# EAGLE design cu (EAGLE 6.5.0)
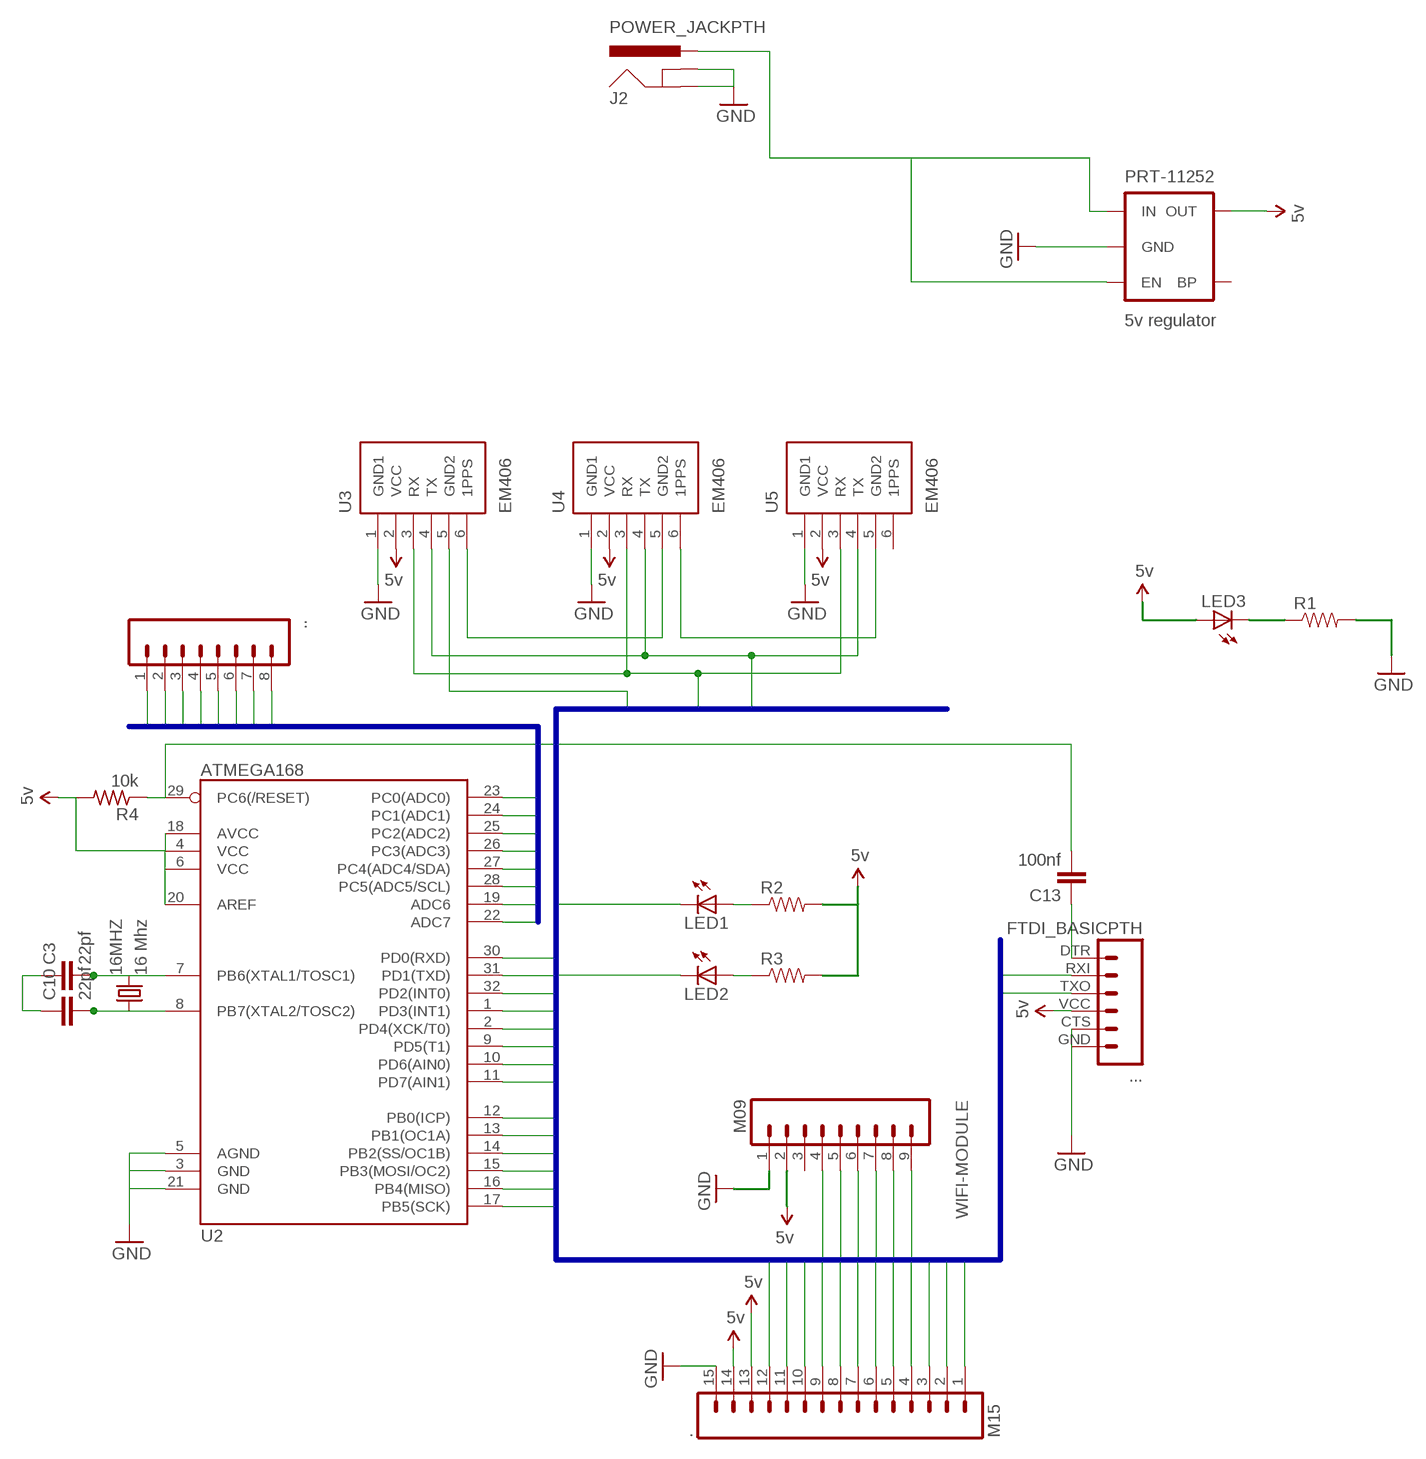
[diagram p0: schematic, sheet 1]

## Parts
16MHZ  16 Mhz  CRYSTALHC49US  [HC49US]
.  M15  [1X15]
..  M081X08  [1X08]
...  FTDI_BASICPTH  [FTDI_BASIC]
C3  22pf  CAP0805  [0805]
C10  22pf  CAP0805  [0805]
C13  100nf  CAP0805  [0805]
J2  POWER_JACKPTH  [POWER_JACK_PTH]
LED1  LED1206  [LED-1206]
LED2  LED1206  [LED-1206]
LED3  LED1206  [LED-1206]
PRT-11252  5v regulator  V_REG_MIC5219SMD  [SOT23-5]
R1  RESISTOR0805-RES  [0805]
R2  RESISTOR0805-RES  [0805]
R3  RESISTOR0805-RES  [0805]
R4  10k  R-US_R0805  [R0805]
U2  ATMEGA168  [TQFP32-08]
U3  EM406  [EM406]
U4  EM406  [EM406]
U5  EM406  [EM406]
WIFI-MODULE  M09  [1X09]

## Nets
5VCC: ....VCC PRT-11252.5(OUT) R4.2 U2.4(VCC) U2.6(VCC) U2.18(AVCC) U2.20(AREF) ; supply symbol labelled 5v
A0: ...1 U2.23(PC0(ADC0))
A1: ...2 U2.24(PC1(ADC1))
A2: ...3 U2.25(PC2(ADC2))
A3: ...4 U2.26(PC3(ADC3))
A4: ...5 U2.27(PC4(ADC4/SDA))
A5: ...6 U2.28(PC5(ADC5/SCL))
A6: ...7 U2.19(ADC6)
A7: ...8 U2.22(ADC7)
D0: ....TXO LED1.C U2.30(PD0(RXD))
D1: ....RXI LED2.C U2.31(PD1(TXD))
D2: ..1 U2.32(PD2(INT0)) WIFI-MODULE.7
D3: ..2 U2.1(PD3(INT1))
D4: ..3 U2.2(PD4(XCK/T0))
D5: ..4 U2.9(PD5(T1)) U3.4(TX) U4.4(TX) U5.4(TX)
D6: ..5 U2.10(PD6(AIN0)) U3.3(RX) U4.3(RX) U5.3(RX)
D7: ..6 U2.11(PD7(AIN1)) U3.5(GND2)
D8: ..7 U2.12(PB0(ICP))
D9: ..8 U2.13(PB1(OC1A)) WIFI-MODULE.9
D10: ..9 U2.14(PB2(SS/OC1B)) WIFI-MODULE.6
D11: ..10 U2.15(PB3(MOSI/OC2)) WIFI-MODULE.4
D12: ..11 U2.16(PB4(MISO)) WIFI-MODULE.5
D13: ..12 U2.17(PB5(SCK)) WIFI-MODULE.8
GND: ..15 ....CTS ....GND J2.GND J2.GNDBREAK PRT-11252.2(GND) R1.2 U2.3(GND) U2.5(AGND) U2.21(GND) U3.1(GND1) U4.1(GND1) U5.1(GND1) WIFI-MODULE.1
N$1: LED1.A R2.1
N$2: LED2.A R3.1
N$3: LED3.C R1.1
N$4: C13.2 R4.1 U2.29(PC6(/RESET))
N$14: 16MHZ.2 C3.2 U2.7(PB6(XTAL1/TOSC1))
N$15: 16MHZ.1 C10.2 U2.8(PB7(XTAL2/TOSC2))
N$27: U3.6(1PPS) U4.5(GND2)
N$28: U4.6(1PPS) U5.5(GND2)
N$29: J2.PWR PRT-11252.1(IN) PRT-11252.3(EN)
N$34: ....DTR C13.1
N$40: C3.1 C10.1
VCC: ..13 ..14 LED3.A R2.2 R3.2 U3.2(VCC) U4.2(VCC) U5.2(VCC) WIFI-MODULE.2 ; supply symbol labelled 5v
Unconnected: PRT-11252.4(BP) U5.6(1PPS) WIFI-MODULE.3

## Buses
D[0..13]
A[0..7]

## Library data of the parts
16MHZ = SparkFun-FreqCtrl:CRYSTAL: Various standard crystals. Proven footprints. Spark Fun Electronics SKU : COM-00534
. = SparkFun-Connectors:M15: Header 15 Standard 15-pin 0.1" header. Use with straight break away headers (SKU : PRT-00116), right angle break away headers (PRT-00553), swiss pins (PRT-00743), machine pins (PRT-00117), and female headers (PRT-00115).
.. = SparkFun-Connectors:M08: Header 8 Standard 8-pin 0.1" header. Use with straight break away headers (SKU : PRT-00116), right angle break away headers (PRT-00553), swiss pins (PRT-00743), machine pins (PRT-00117), and female headers (PRT-00115).
... = SparkFun-Connectors:FTDI_BASIC: FTDI Basic header with labels
C3 C10 C13 = SparkFun-Passives:CAP: Capacitor Standard 0603 ceramic capacitor, and 0.1" leaded capacitor.
J2 = SparkFun-Connectors:POWER_JACK: Power Jack This is the standard 5.5mm barrel jack for power. The PTH is the most common, proven, reliable, footprint. All others are experimental. The Slot footprint only works if the mill layer is transmitted to the PCB fab house so be warned. Spark Fun Electronics SKU : PRT-00119. Mating wall wart : TOL-00298 (and others)
LED1-LED3 = SparkFun-LED:LED: LEDs Standard schematic elements and footprints for 5mm, 3mm, 1206, and 0603 sized LEDs. 5mm - Spark Fun Electronics SKU : COM-00529 (and others)
PRT-11252 = SparkFun-PowerIC:V_REG_MIC5219: V_REG MIC5219 Standard 500mA LDO voltage regulator in SOT-23 layout. Micrel part MIC5219. BP (by-pass) pin is used to lower output noise with 470pF cap, may be left open.
R1-R3 = SparkFun-Passives:RESISTOR: Resistor Basic schematic elements and footprints for 0603, 1206, and PTH resistors.
R4 = adafruit:R-US_: RESISTOR, American symbol
U2 = SparkFun-DigitalIC:ATMEGA168: Atmel 32-pin 8-bit micro, 16k flash.
U3-U5 = SparkFun-Connectors:EM406: EM406 GPS Connector Proven layout and schematic for EM406 connector. Spark Fun Electronics SKU : GPS-00579
WIFI-MODULE = SparkFun-Connectors:M09: Header 9 Standard 9-pin 0.1" header. Use with straight break away headers (SKU : PRT-00116), right angle break away headers (PRT-00553), swiss pins (PRT-00743), machine pins (PRT-00117), and female headers (PRT-00115).

## Board
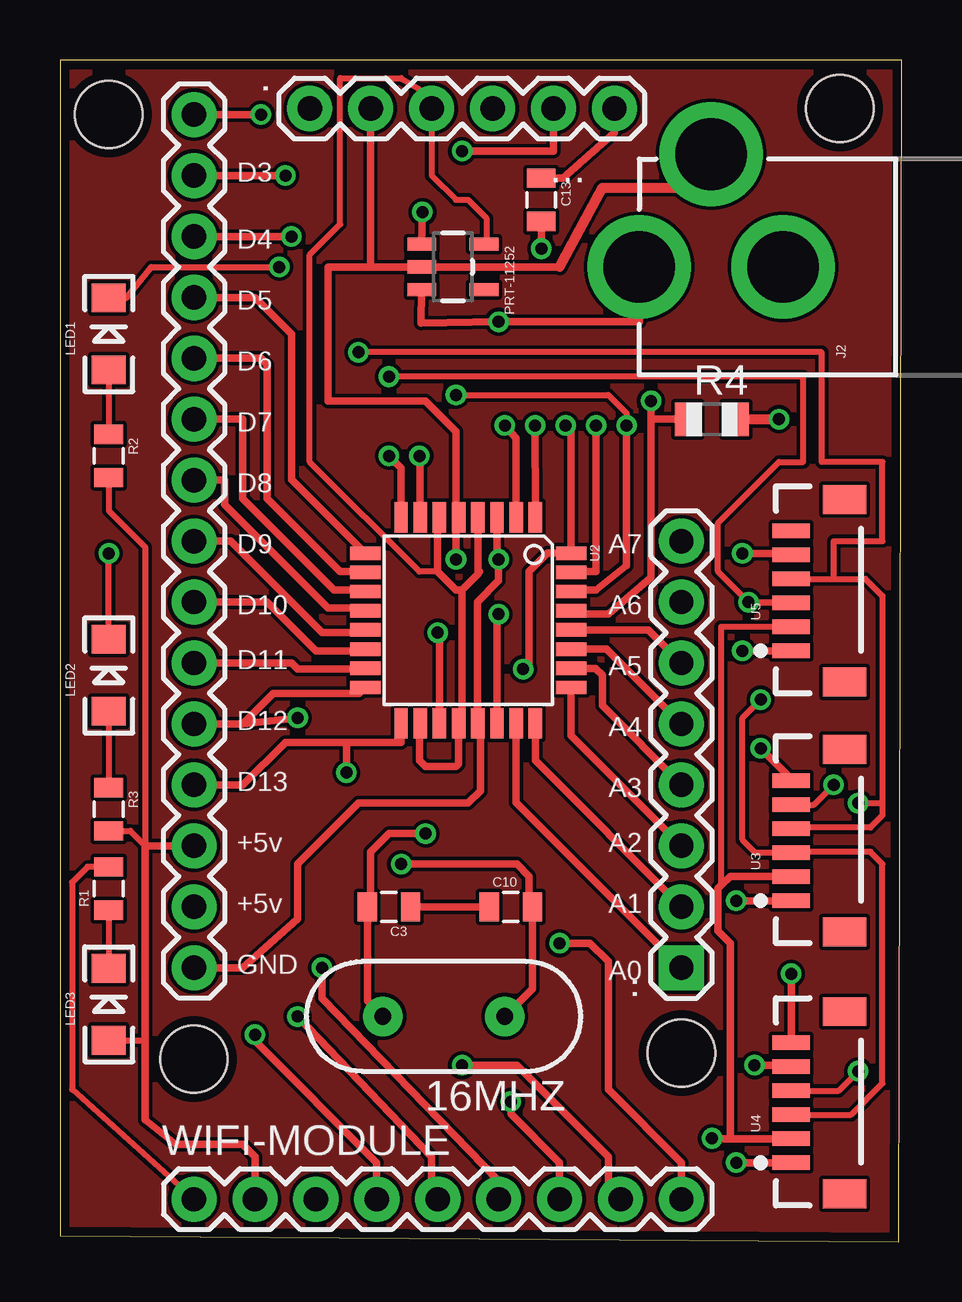
[diagram p1: board, top side]
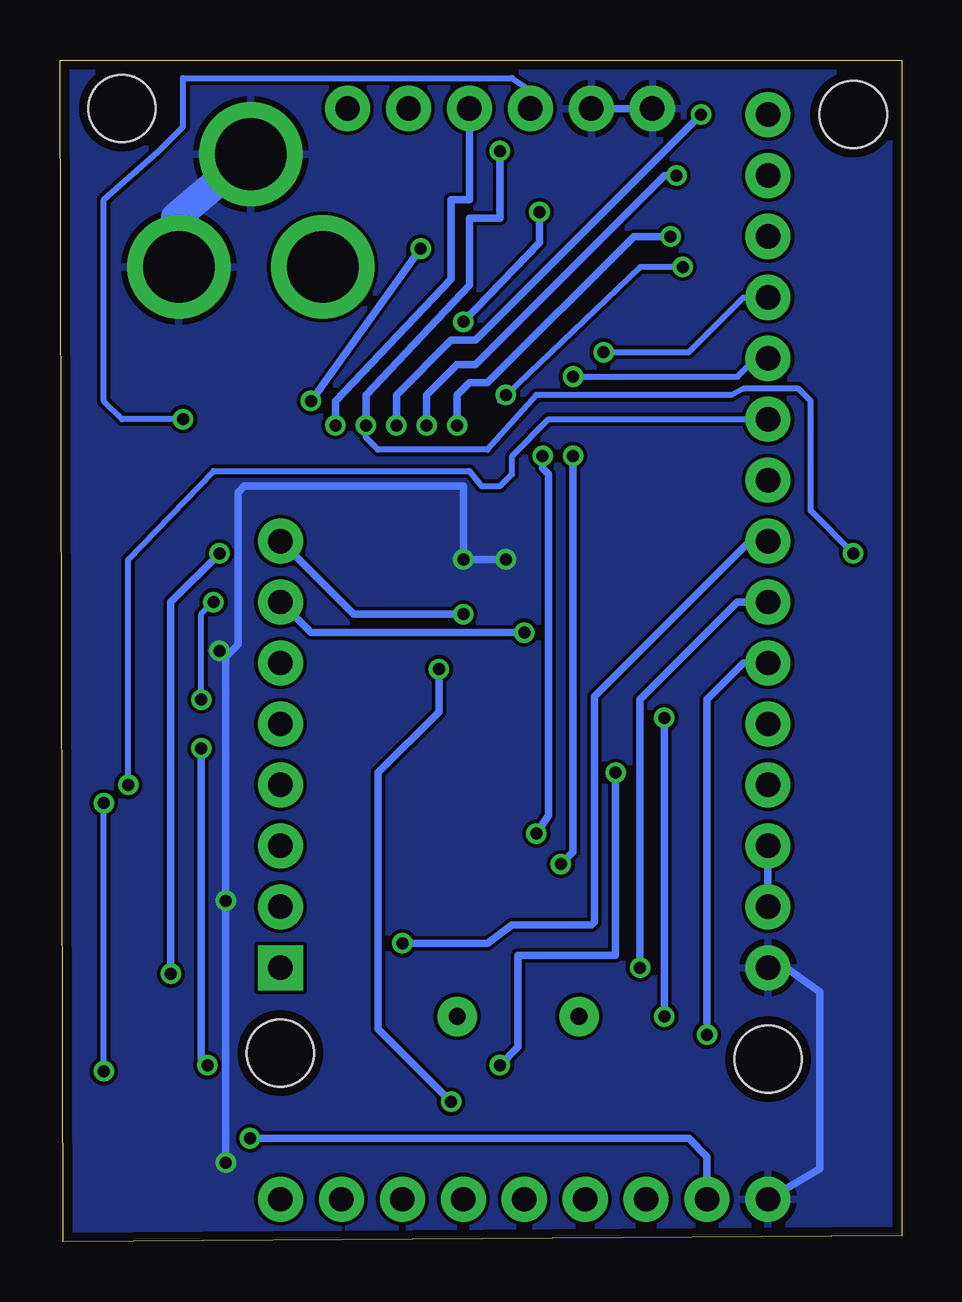
[diagram p2: board, bottom side, seen from below]

Size 35.1 x 49.27 mm. Coordinates in mm from the lower left corner, seen from the top.
Outline: 0,0.25 34.98,0 35.1,49.27 0,49.27 0,0.25
Copper layers (1*16): Top 0.0356mm / dielectric 1.5011mm / Bottom 0.0356mm
Design rules "OSHPark": minimum track width 6mil, minimum drill 13mil, track to track 6mil, track to pad 6mil, pad to pad 6mil, via to via 6mil, smd to smd 6mil, copper to edge 15mil, drill to drill 6mil, minimum pad ring 7mil, minimum via ring 7mil, stop-mask expansion 3mil, vias tented up to drill 0mil, thermal gap 10mil
Holes 2.8 mm at 32.51,47.24 2.03,46.99 25.91,7.87 5.59,7.62

### Footprints (pad centres in the part's own frame; a part is rotated, then mirrored left to right if it is on the bottom)
HC49US = drill 0.7 pad 1.651: 1 -2.54,0; 2 2.54,0
1X15 = drill 1.016 pad 1.88: 1 0,0; 2 2.54,0; 3 5.08,0; 4 7.62,0; 5 10.16,0; 6 12.7,0; 7 15.24,0; 8 17.78,0; 9 20.32,0; 10 22.86,0; 11 25.4,0; 12 27.94,0; 13 30.48,0; 14 33.02,0; 15 35.56,0
1X08 = drill 1.016 pad 1.88 square: 1 0,0 | drill 1.016 pad 1.88: 2 2.54,0; 3 5.08,0; 4 7.62,0; 5 10.16,0; 6 12.7,0; 7 15.24,0; 8 17.78,0
FTDI_BASIC = drill 1.016 pad 1.88: CTS 10.16,0; DTR 0,0; GND 12.7,0; RXI 2.54,0; TXO 5.08,0; VCC 7.62,0
0805 = smd 0.8 x 1.2: 1 -0.9,0; 2 0.9,0
POWER_JACK_PTH = drill 2.997 pad 4.318: GND 0,7.7; GNDBREAK 4.7,10.7; PWR 0,13.7
LED-1206 = smd 1.2 x 1.4: A -1.5,0; C 1.5,0
SOT23-5 = smd 0.55 x 1.2: 1 -0.95,-1.3; 2 0,-1.3; 3 0.95,-1.3; 4 0.95,1.3; 5 -0.95,1.3
R0805 = smd 1.1 x 1.4: 1 -1,0; 2 1,0
TQFP32-08 = smd 1.27 x 0.559: 1 -4.293,2.8; 2 -4.293,2; 3 -4.293,1.2; 4 -4.293,0.4; 5 -4.293,-0.4; 6 -4.293,-1.2; 7 -4.293,-2; 8 -4.293,-2.8; 17 4.293,-2.8; 18 4.293,-2; 19 4.293,-1.2; 20 4.293,-0.4; 21 4.293,0.4; 22 4.293,1.2; 23 4.293,2; 24 4.293,2.8 | smd 0.559 x 1.27: 9 -2.8,-4.293; 10 -2,-4.293; 11 -1.2,-4.293; 12 -0.4,-4.293; 13 0.4,-4.293; 14 1.2,-4.293; 15 2,-4.293; 16 2.8,-4.293; 25 2.8,4.293; 26 2,4.293; 27 1.2,4.293; 28 0.4,4.293; 29 -0.4,4.293; 30 -1.2,4.293; 31 -2,4.293; 32 -2.8,4.293
EM406 = smd 0.6 x 1.55: 1 0,0; 2 1,0; 3 2,0; 4 3,0; 5 4,0; 6 5,0 | smd 1.2 x 1.8: P$1 -1.3,-2.225; P$2 6.3,-2.225
1X09 = drill 1.016 pad 1.88: 1 0,0; 2 2.54,0; 3 5.08,0; 4 7.62,0; 5 10.16,0; 6 12.7,0; 7 15.24,0; 8 17.78,0; 9 20.32,0

### Placement (x,y rotation side)
16MHZ  16,9.4 180 top
.  5.59,46.99 270 top
..  25.91,11.43 90 top
...  23.11,47.24 180 top
C3  13.72,13.97 180 top
C10  18.8,13.97 0 top
C13  20.07,43.43 270 top
J2  37.85,40.64 90 top
LED1  2.03,37.85 90 top
LED2  2.03,23.62 90 top
LED3  2.03,9.91 90 top
PRT-11252  16.38,40.64 270 top
R1  2.03,14.73 90 top
R2  2.03,32.77 270 top
R3  2.03,18.03 270 top
R4  27.18,34.29 0 top
U2  17.02,25.91 270 top
U3  30.48,14.22 90 top
U4  30.48,3.3 90 top
U5  30.48,24.64 90 top
WIFI-MODULE  5.59,1.78 0 top

### Tracks (layer width: path | path; a pad name or v marks a point on that pad's centre or on a via)
3.3V
  pour Top: 0,0.25 0,49.28 35.05,49.28 35.05,0
5VCC  (via drill 0.5 pad 0.25)
  Top 0.254: PRT-11252.5 17.78,41.69 17.78,42.67 17.02,43.43 16.51,43.43 15.49,44.45 ....VCC 15.49,47.75 14.22,48.51 11.68,48.51 11.68,42.42 10.41,41.15 10.41,32.51 14.99,27.94 15.75,27.94 | U2.4 17.42,28.05 17.53,27.94 16.76,27.18
  Top 0.305: 16.76,27.18 16.76,21.76 U2.20 16.62,19.92 16.51,19.81 15.24,19.81 14.99,20.07 14.99,21.58 U2.18 | 16.76,27.18 17.42,27.83 U2.4 | U2.6 15.75,30.13 15.75,27.94 16.51,27.18 16.76,27.18
  Top 0.406: R4.2 v29.97,34.29
  Bottom 0.254: v29.97,34.29 32.51,34.29 33.27,35.05 33.27,43.43 30.99,45.47 29.97,46.48 29.97,48.51 16.26,48.51 15.49,48.01 ....VCC
A0
  Top 0.305: ...1 19.02,18.32 U2.23
A1
  Top 0.305: ...2 19.82,20.06 U2.24
A2
  Top 0.305: ...3 21.31,21.11 U2.25
A3
  Top 0.305: ...4 22.61,22.35 22.61,23.62 22.32,23.91 U2.26
A4
  Top 0.305: ...5 22.79,24.71 U2.27
A5
  Top 0.305: ...6 24.53,25.51 U2.28
A6  (via drill 0.5 pad 0.25)
  Top 0.305: v15.75,25.4 15.82,25.33 U2.19
  Bottom 0.305: ...7 24.64,25.4 v15.75,25.4
A7  (via drill 0.5 pad 0.25)
  Top 0.305: v18.29,26.16 18.22,26.09 U2.22
  Bottom 0.305: ...8 22.86,26.16 v18.29,26.16
D0  (via drill 0.5 pad 0.25)
  Top 0.254: LED1.C 2.77,39.35 3.81,40.64 v9.14,40.64 | v16.51,35.31 22.86,35.31 23.62,34.54 v23.62,34.04
  Top 0.305: U2.30 21.38,27.18 22.35,27.18 23.62,28.19 v23.62,34.04
  Bottom 0.254: v9.14,40.64 10.92,40.64 v16.51,35.31 16.76,35.05
  Bottom 0.305: v23.62,34.04 23.62,35.05 18.8,40.13 18.8,43.43 18.03,43.43 ....TXO
D1  (via drill 0.5 pad 0.25)
  Top 0.254: LED2.C v2.03,28.7
  Top 0.305: U2.31 21.34,27.94 22.35,27.94 v22.35,34.04 | v16.76,45.47 20.57,45.47 ....RXI
  Bottom 0.254: v2.03,28.7 3.81,30.48 3.81,35.05 4.32,35.56 6.6,35.56 7.11,35.31 15.24,35.31 17.27,33.02 21.84,33.02 22.35,33.53 v22.35,34.04
  Bottom 0.305: v22.35,34.04 22.35,35.31 18.03,39.88 18.03,42.67 16.76,42.67 v16.76,45.47
D2  (via drill 0.5 pad 0.25)
  Top 0.305: ..1 v8.38,46.99 | v21.08,34.04 21.31,34.01 U2.32 20.33,28.71 19.56,27.94 19.56,24.13 v19.3,23.88 | WIFI-MODULE.7 20.83,3.3 18.8,5.33 v18.8,5.84
  Bottom 0.305: v8.38,46.99 17.78,37.59 18.8,37.59 21.08,35.31 v21.08,34.04 | v18.8,5.84 21.84,8.89 21.84,19.56 19.3,22.1 v19.3,23.88
D3  (via drill 0.5 pad 0.25)
  Top 0.305: ..2 v9.4,44.45 | v19.81,34.04 19.81,33.78 19.82,30.74 U2.1
  Bottom 0.305: v9.4,44.45 9.91,44.45 17.78,36.58 18.54,36.58 19.81,35.31 v19.81,34.04
D4  (via drill 0.5 pad 0.25)
  Top 0.305: ..3 v9.65,41.91 | v18.54,34.04 19.02,33.5 U2.2
  Bottom 0.305: v9.65,41.91 11.18,41.91 17.27,35.81 18.03,35.81 18.54,35.31 v18.54,34.04
D5  (via drill 0.5 pad 0.25)
  Top 0.254: v12.45,37.08 31.75,37.08 31.75,32.51 34.29,32.51 34.29,29.21 32.26,29.21 32.26,27.64 U5.4 33.58,27.64 34.29,26.92 34.29,18.29 | 34.29,18.29 34.29,17.78 33.78,17.27 30.53,17.27 U3.4 | U4.4 32.46,6.3 v33.27,7.11 | v33.27,18.29 34.29,18.29
  Top 0.305: U2.9 9.65,31.78 9.65,37.85 8.13,39.37 ..4
  Bottom 0.254: v12.45,37.08 8.89,37.08 6.6,39.37 ..4 | v33.27,7.11 v33.27,18.29
D6  (via drill 0.5 pad 0.25)
  Top 0.254: U4.3 32.99,5.3 34.29,6.6 34.29,15.75 33.78,16.26 30.51,16.26 U3.3 28.99,16.22 28.45,16.76 28.45,21.84 v29.21,22.61 | v28.7,26.67 30.45,26.67 U5.3 28.73,26.64 v28.7,26.67 | v28.7,26.67 27.43,27.94 27.43,29.97 29.97,32.51 30.99,32.51 30.99,36.07 v13.72,36.07
  Top 0.305: U2.10 12.69,27.94 11.68,27.94 8.64,30.99 8.64,36.58 8.38,36.83 ..5
  Bottom 0.254: v29.21,22.61 29.21,26.16 v28.7,26.67 | v13.72,36.07 6.86,36.07 6.1,36.83 ..5
D7  (via drill 0.5 pad 0.25)
  Top 0.254: U3.5 31.43,18.22 v32.26,19.05
  Top 0.305: U2.11 12.65,27.18 11.43,27.18 7.62,30.99 7.62,34.29 ..6
  Bottom 0.254: v32.26,19.05 32.26,28.45 28.7,32.13 18.03,32.13 17.53,31.5 16.76,31.5 16.26,32 16.26,32.77 14.73,34.29 ..6
D8
  Top 0.305: U2.12 12.62,26.42 11.18,26.42 6.86,30.73 6.86,31.75 ..7
D9  (via drill 0.5 pad 0.25)
  Top 0.305: U2.13 12.62,25.4 10.92,25.4 7.11,29.21 ..8 | WIFI-MODULE.9 25.91,3.3 22.86,6.35 22.86,11.68 22.1,12.45 v20.83,12.45
  Bottom 0.305: v20.83,12.45 17.27,12.45 16.26,13.21 12.95,13.21 12.83,13.33 12.83,22.73 6.35,29.21 ..8
D10  (via drill 0.5 pad 0.25)
  Top 0.305: U2.14 12.65,24.64 10.67,24.64 8.64,26.67 ..9 | WIFI-MODULE.6 18.29,2.54 10.92,10.16 v10.92,11.43
  Bottom 0.305: v10.92,11.43 10.92,22.61 6.86,26.67 ..9
D11  (via drill 0.5 pad 0.25)
  Top 0.305: U2.15 12.69,23.88 9.91,23.88 9.65,24.13 ..10 | WIFI-MODULE.4 13.21,3.3 8.13,8.38 v8.13,8.64
  Bottom 0.305: v8.13,8.64 8.13,22.61 6.6,24.13 ..10
D12  (via drill 0.5 pad 0.25)
  Top 0.305: U2.16 12.48,22.86 8.89,22.86 7.62,21.59 | 7.62,21.59 ..11 | WIFI-MODULE.5 15.49,1.52 15.49,3.56 v9.91,9.4 | v9.91,21.84 7.62,21.59
  Bottom 0.305: v9.91,9.4 v9.91,21.84
D13  (via drill 0.5 pad 0.25)
  Top 0.305: U2.17 14.22,20.83 11.94,20.83 | 11.94,20.83 9.4,20.83 7.62,19.05 ..12 | WIFI-MODULE.8 22.86,1.78 22.86,3.56 19.05,7.37 v16.76,7.37 | v11.94,19.56 11.94,20.83
  Bottom 0.305: v16.76,7.37 16,8.13 16,11.94 11.94,11.94 v11.94,19.56
GND  (via drill 0.5 pad 0.25)
  Top 0.254: R1.2 1.15,15.63 0.51,14.99 0.51,6.35 WIFI-MODULE.1
  Top 0.305: v16.51,28.45 16.51,30.09 U2.5 16.51,30.31 16.51,33.78 15.24,35.05 11.18,35.05 11.18,40.64 12.95,40.64 | U2.3 18.22,28.52 v18.29,28.45 18.29,27.56 17.4,26.67 17.4,21.63 U2.21 17.53,21.51 17.53,18.8 17.02,18.29 12.45,18.29 9.91,15.75 9.91,13.46 7.62,11.43 ..15 | U5.1 v28.45,24.64 | v28.19,14.22 U3.1 | U4.1 v28.19,3.3 | ....CTS 12.95,40.64 | 20.83,40.64 PRT-11252.2 12.95,40.64
  Top 0.406: 20.83,40.64 22.61,43.94 25.75,43.94 J2.GNDBREAK
  Bottom 0.305: ....GND ....CTS | v16.51,28.45 v18.29,28.45 18.29,31.5 27.43,31.5 27.69,31.24 27.69,24.89 28.19,24.38 | v28.45,24.64 28.19,24.38 | v28.19,3.3 v28.19,14.22 28.19,24.38 | WIFI-MODULE.1 3.43,3.05 3.43,10.41 4.83,11.43 ..15
  Bottom 1.27: J2.GND 30.26,42.72 J2.GNDBREAK
  pour Bottom: 34.8,49.02 0,49.28 0.25,0.25 35.05,0
N$1
  Top 0.254: LED1.A R2.1
N$2
  Top 0.254: LED2.A R3.1
N$3
  Top 0.254: R1.1 LED3.C
N$4  (via drill 0.5 pad 0.25)
  Top 0.305: U2.29 21.46,26.16 22.86,26.16 24.64,27.69 24.64,34.29 | 24.64,34.29 R4.1 | C13.2 v20.07,41.4 | v24.64,35.05 24.64,34.29
  Bottom 0.305: v20.07,41.4 v24.64,35.05
N$14  (via drill 0.5 pad 0.25)
  Top 0.305: 16MHZ.2 12.82,10.04 C3.2 12.95,14.11 12.95,16.26 13.72,17.02 v15.24,17.02 | v14.99,32.77 15.02,32.73 U2.7
  Bottom 0.305: v15.24,17.02 14.73,17.78 14.73,32 14.99,32.26 v14.99,32.77
N$15  (via drill 0.5 pad 0.25)
  Top 0.305: 16MHZ.1 19.7,10.55 C10.2 19.56,14.11 19.56,15.24 19.05,15.75 v14.22,15.75 | v13.72,32.77 14.22,32.26 U2.8
  Bottom 0.305: v14.22,15.75 13.72,16.26 v13.72,32.77
N$27  (via drill 0.5 pad 0.25)
  Top 0.305: U4.5 30.42,7.37 v28.96,7.37 | v29.21,20.57 30.48,19.3 U3.6
  Bottom 0.305: v28.96,7.37 29.21,7.62 v29.21,20.57
N$28  (via drill 0.5 pad 0.25)
  Top 0.305: U5.5 30.42,28.7 v28.45,28.7 | v30.48,11.18 U4.6
  Bottom 0.305: v28.45,28.7 30.48,26.67 v30.48,11.18
N$29  (via drill 0.5 pad 0.25)
  Top 0.305: PRT-11252.1 15.11,42.96 v15.11,42.93 | PRT-11252.3 15.05,38.29 v18.29,38.35 24.15,38.35 J2.PWR
  Bottom 0.305: v15.11,42.93 15.11,41.66 v18.29,38.35
N$34
  Top 0.305: ....DTR 23.11,46.23 20.97,44.33 C13.1
N$40
  Top 0.305: C3.1 C10.1
VCC  (via drill 0.5 pad 0.25)
  Top 0.254: U5.2 27.56,25.64 27.56,14.86 | R2.2 2.03,30.48 3.56,28.96 3.56,16.51 2.93,17.13 R3.2 | LED3.A 3.53,8.41 3.56,8.38
  Top 0.305: ..13 3.56,16.51 3.56,8.38 3.56,5.08 4.83,4.06 7.62,4.06 8.13,3.56 WIFI-MODULE.2 | v27.18,4.32 27.67,4.3 U4.2 27.96,4.3 27.94,4.32 27.94,12.45 27.43,12.95 27.43,14.73 27.56,14.86 27.94,15.24 30.46,15.24 U3.2
  Bottom 0.305: WIFI-MODULE.2 8.13,3.56 8.89,4.32 v27.18,4.32 | ..13 ..14

### Text on the board
tPlace: D3 | D4 | D5 | D6 | D7 | D8 | D9 | A7 | D10 | A6 | D11 | A5 | D12 | A4 | D13 | A3 | +5v | A2 | +5v | A1 | GND | A0